# EAGLE schematic ATmga8_testBoard_v4 (EAGLE 6.5.0)
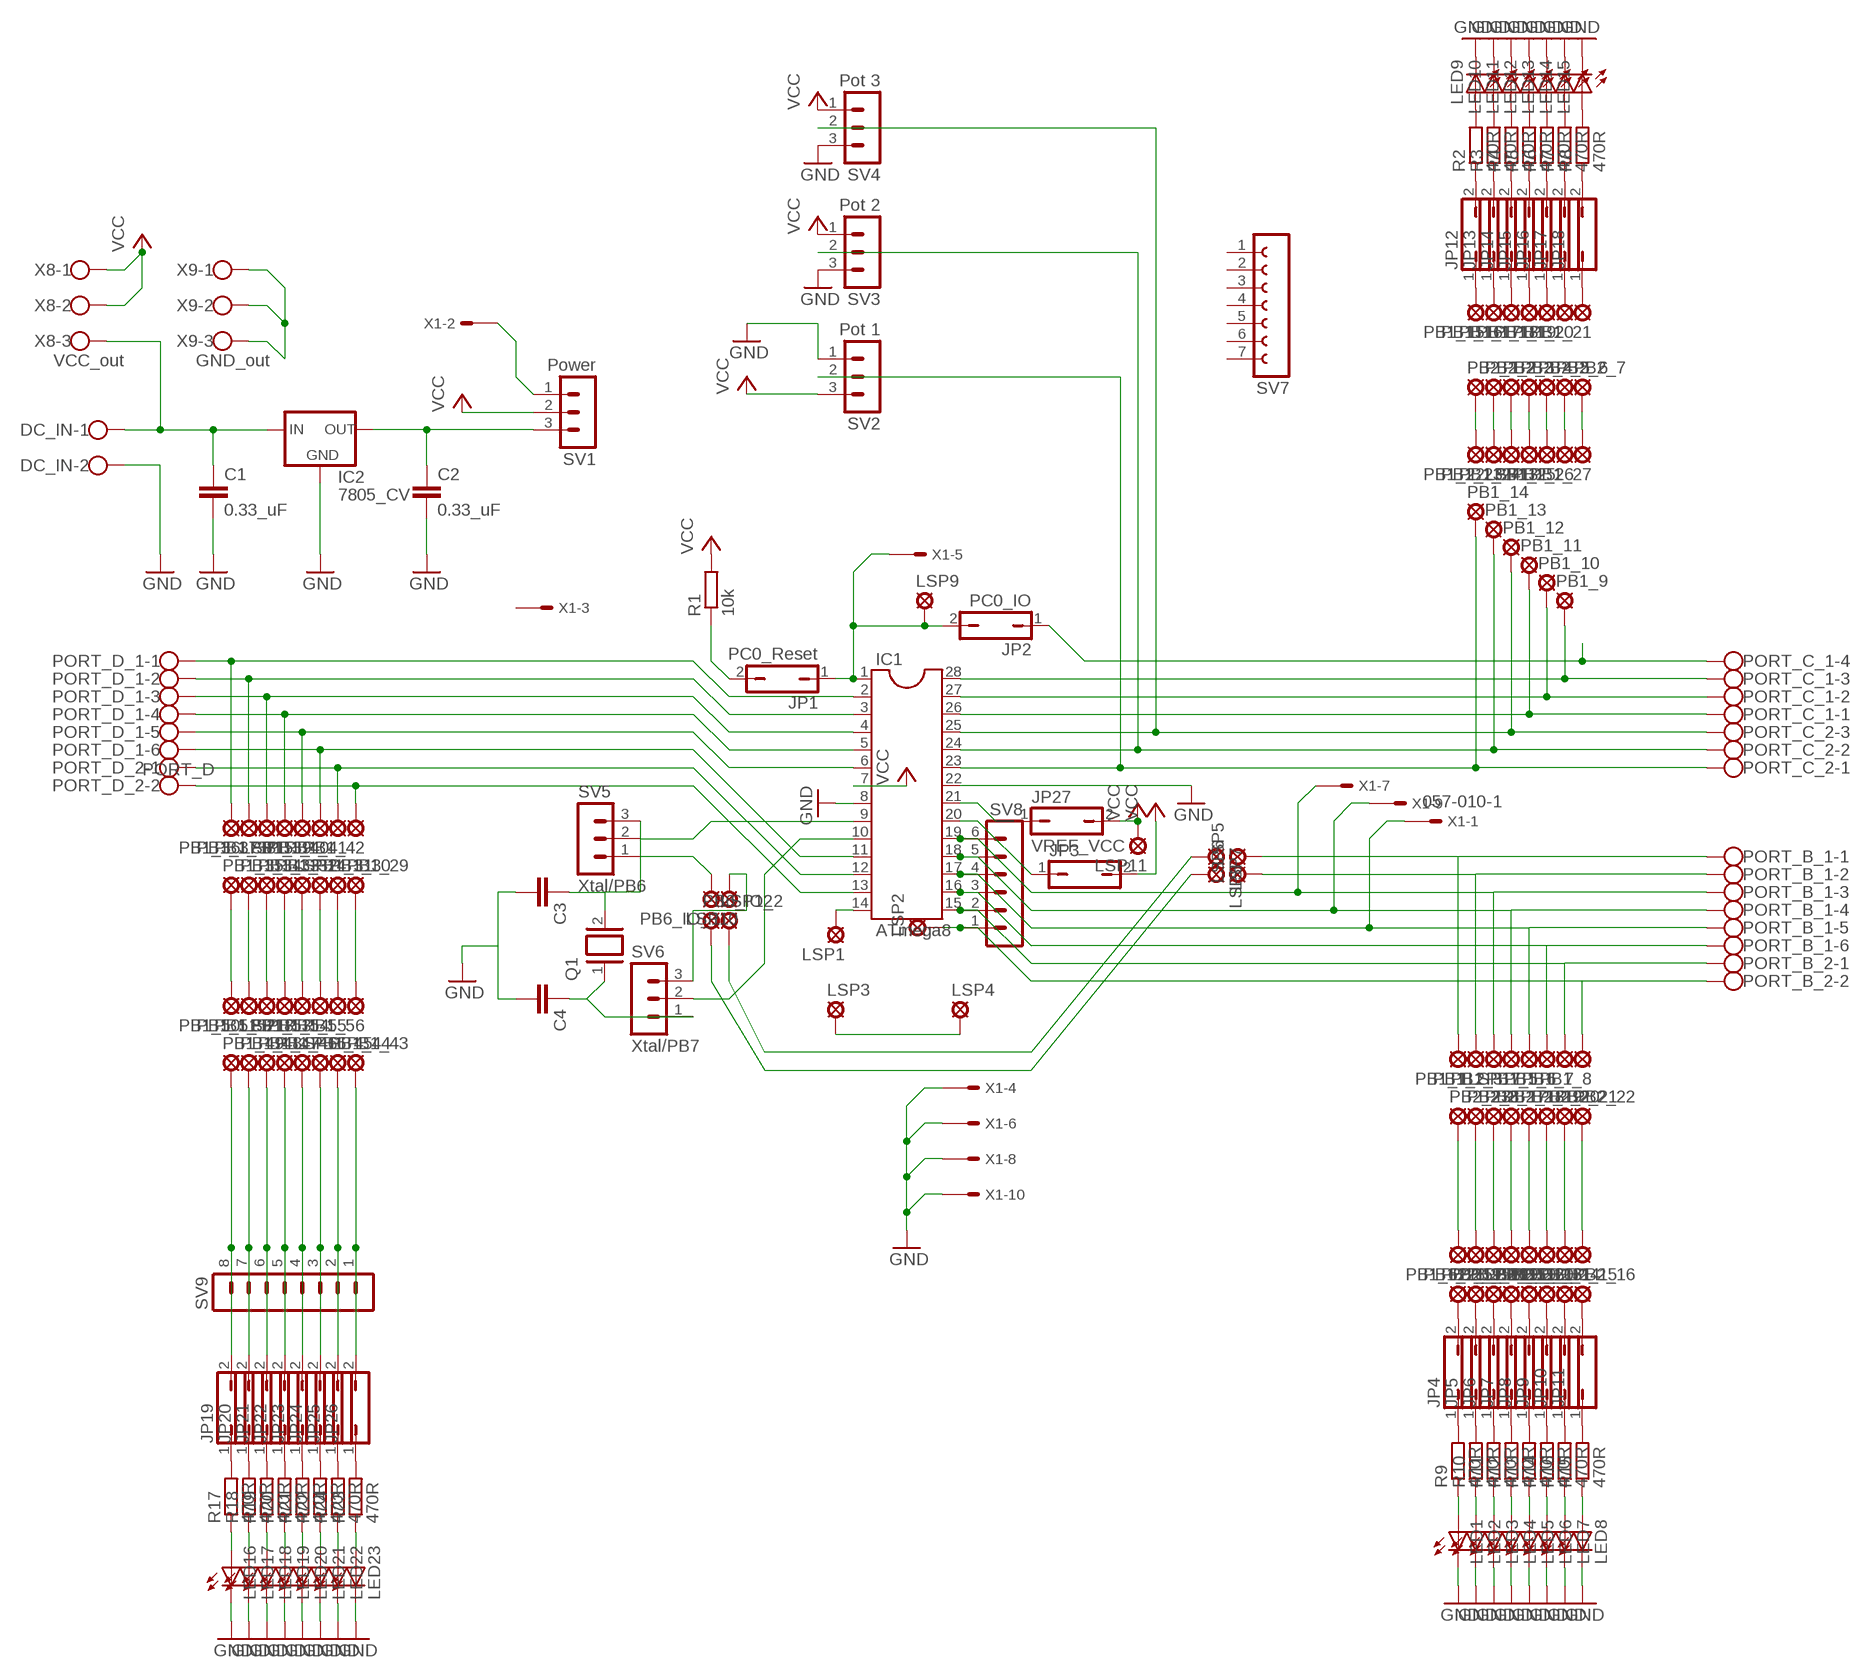
[diagram p0: schematic, sheet 1]

## Parts
C1  0.33_uF  C5/2.5  [C5B2.5]
C2  0.33_uF  C5/2.5  [C5B2.5]
C3  C-EU025-024X044  [C025-024X044]
C4  C-EU025-024X044  [C025-024X044]
DC_IN  W237-102  [W237-102]
IC1  ATmega8  DIL28-3  [DIL28-3]
IC2  7805_CV  78XXS  [78XXS]
JP1  PC0_Reset  JP1Q  [JP1]
JP2  PC0_IO  JP1Q  [JP1]
JP3  JP1Q  [JP1]
JP4  JP1Q  [JP1]
JP5  JP1Q  [JP1]
JP6  JP1Q  [JP1]
JP7  JP1Q  [JP1]
JP8  JP1Q  [JP1]
JP9  JP1Q  [JP1]
JP10  JP1Q  [JP1]
JP11  JP1Q  [JP1]
JP12  JP1Q  [JP1]
JP13  JP1Q  [JP1]
JP14  JP1Q  [JP1]
JP15  JP1Q  [JP1]
JP16  JP1Q  [JP1]
JP17  JP1Q  [JP1]
JP18  JP1Q  [JP1]
JP19  JP1Q  [JP1]
JP20  JP1Q  [JP1]
JP21  JP1Q  [JP1]
JP22  JP1Q  [JP1]
JP23  JP1Q  [JP1]
JP24  JP1Q  [JP1]
JP25  JP1Q  [JP1]
JP26  JP1Q  [JP1]
JP27  VREF_VCC  JP1Q  [JP1]
LED1  LED3MM  [LED3MM]
LED2  LED3MM  [LED3MM]
LED3  LED3MM  [LED3MM]
LED4  LED3MM  [LED3MM]
LED5  LED3MM  [LED3MM]
LED6  LED3MM  [LED3MM]
LED7  LED3MM  [LED3MM]
LED8  LED3MM  [LED3MM]
LED9  LED3MM  [LED3MM]
LED10  LED3MM  [LED3MM]
LED11  LED3MM  [LED3MM]
LED12  LED3MM  [LED3MM]
LED13  LED3MM  [LED3MM]
LED14  LED3MM  [LED3MM]
LED15  LED3MM  [LED3MM]
LED16  LED3MM  [LED3MM]
LED17  LED3MM  [LED3MM]
LED18  LED3MM  [LED3MM]
LED19  LED3MM  [LED3MM]
LED20  LED3MM  [LED3MM]
LED21  LED3MM  [LED3MM]
LED22  LED3MM  [LED3MM]
LED23  LED3MM  [LED3MM]
LSP1  LSP10  [LSP10]
LSP2  LSP10  [LSP10]
LSP3  LSP10  [LSP10]
LSP4  LSP10  [LSP10]
LSP5  LSP10  [LSP10]
LSP6  LSP10  [LSP10]
LSP7  LSP10  [LSP10]
LSP8  LSP10  [LSP10]
LSP9  LSP10  [LSP10]
LSP10  LSP10  [LSP10]
LSP11  LSP10  [LSP10]
LSP12  LSP10  [LSP10]
LSP13  LSP10  [LSP10]
LSP14  LSP10  [LSP10]
LSP15  LSP10  [LSP10]
LSP16  LSP10  [LSP10]
LSP17  LSP10  [LSP10]
LSP18  LSP10  [LSP10]
LSP19  LSP10  [LSP10]
PB1_1  LSP10  [LSP10]
PB1_2  LSP10  [LSP10]
PB1_3  LSP10  [LSP10]
PB1_5  LSP10  [LSP10]
PB1_6  LSP10  [LSP10]
PB1_7  LSP10  [LSP10]
PB1_8  LSP10  [LSP10]
PB1_9  LSP10  [LSP10]
PB1_10  LSP10  [LSP10]
PB1_11  LSP10  [LSP10]
PB1_12  LSP10  [LSP10]
PB1_13  LSP10  [LSP10]
PB1_14  LSP10  [LSP10]
PB1_15  LSP10  [LSP10]
PB1_16  LSP10  [LSP10]
PB1_17  LSP10  [LSP10]
PB1_18  LSP10  [LSP10]
PB1_19  LSP10  [LSP10]
PB1_20  LSP10  [LSP10]
PB1_21  LSP10  [LSP10]
PB1_22  LSP10  [LSP10]
PB1_23  LSP10  [LSP10]
PB1_24  LSP10  [LSP10]
PB1_25  LSP10  [LSP10]
PB1_26  LSP10  [LSP10]
PB1_27  LSP10  [LSP10]
PB1_28  LSP10  [LSP10]
PB1_29  LSP10  [LSP10]
PB1_30  LSP10  [LSP10]
PB1_31  LSP10  [LSP10]
PB1_32  LSP10  [LSP10]
PB1_33  LSP10  [LSP10]
PB1_34  LSP10  [LSP10]
PB1_35  LSP10  [LSP10]
PB1_36  LSP10  [LSP10]
PB1_37  LSP10  [LSP10]
PB1_38  LSP10  [LSP10]
PB1_39  LSP10  [LSP10]
PB1_40  LSP10  [LSP10]
PB1_41  LSP10  [LSP10]
PB1_42  LSP10  [LSP10]
PB1_43  LSP10  [LSP10]
PB1_44  LSP10  [LSP10]
PB1_45  LSP10  [LSP10]
PB1_46  LSP10  [LSP10]
PB1_47  LSP10  [LSP10]
PB1_48  LSP10  [LSP10]
PB1_49  LSP10  [LSP10]
PB1_50  LSP10  [LSP10]
PB1_51  LSP10  [LSP10]
PB1_52  LSP10  [LSP10]
PB1_53  LSP10  [LSP10]
PB1_54  LSP10  [LSP10]
PB1_55  LSP10  [LSP10]
PB1_56  LSP10  [LSP10]
PB1_57  LSP10  [LSP10]
PB1_58  LSP10  [LSP10]
PB1_59  LSP10  [LSP10]
PB1_60  LSP10  [LSP10]
PB1_61  LSP10  [LSP10]
PB1_62  LSP10  [LSP10]
PB2_1  LSP10  [LSP10]
PB2_2  LSP10  [LSP10]
PB2_3  LSP10  [LSP10]
PB2_4  LSP10  [LSP10]
PB2_5  LSP10  [LSP10]
PB2_6  LSP10  [LSP10]
PB2_7  LSP10  [LSP10]
PB2_8  LSP10  [LSP10]
PB2_9  LSP10  [LSP10]
PB2_10  LSP10  [LSP10]
PB2_11  LSP10  [LSP10]
PB2_12  LSP10  [LSP10]
PB2_13  LSP10  [LSP10]
PB2_14  LSP10  [LSP10]
PB2_15  LSP10  [LSP10]
PB2_16  LSP10  [LSP10]
PB2_17  LSP10  [LSP10]
PB2_18  LSP10  [LSP10]
PB2_19  LSP10  [LSP10]
PB2_20  LSP10  [LSP10]
PB2_21  LSP10  [LSP10]
PB2_22  LSP10  [LSP10]
PB2_23  LSP10  [LSP10]
PB6_IO_1  LSP10  [LSP10]
PB6_IO_2  LSP10  [LSP10]
PORT_B_1  W237-6  [W237-6]
PORT_B_2  W237-102  [W237-102]
PORT_C_1  W237-4  [W237-4]
PORT_C_2  W237-103  [W237-103]
PORT_D_1  PORT_D  W237-6  [W237-6]
PORT_D_2  W237-102  [W237-102]
Q1  XTAL  [Q]
R1  10k  R-EU_0204/7  [0204/7]
R2  470R  R-EU_0207/7  [0207/7]
R3  470R  R-EU_0207/7  [0207/7]
R4  470R  R-EU_0207/7  [0207/7]
R5  470R  R-EU_0207/7  [0207/7]
R6  470R  R-EU_0207/7  [0207/7]
R7  470R  R-EU_0207/7  [0207/7]
R8  470R  R-EU_0207/7  [0207/7]
R9  470R  R-EU_0207/7  [0207/7]
R10  470R  R-EU_0207/7  [0207/7]
R11  470R  R-EU_0207/7  [0207/7]
R12  470R  R-EU_0207/7  [0207/7]
R13  470R  R-EU_0207/7  [0207/7]
R14  470R  R-EU_0207/7  [0207/7]
R15  470R  R-EU_0207/7  [0207/7]
R16  470R  R-EU_0207/7  [0207/7]
R17  470R  R-EU_0207/7  [0207/7]
R18  470R  R-EU_0207/7  [0207/7]
R19  470R  R-EU_0207/7  [0207/7]
R20  470R  R-EU_0207/7  [0207/7]
R21  470R  R-EU_0207/7  [0207/7]
R22  470R  R-EU_0207/7  [0207/7]
R23  470R  R-EU_0207/7  [0207/7]
R24  470R  R-EU_0207/7  [0207/7]
SV1  Power  MA03-1  [MA03-1]
SV2  Pot 1  MA03-1  [MA03-1]
SV3  Pot 2  MA03-1  [MA03-1]
SV4  Pot 3  MA03-1  [MA03-1]
SV5  Xtal/PB6  MA03-1  [MA03-1]
SV6  Xtal/PB7  MA03-1  [MA03-1]
SV7  FE07-1  [FE07]
SV8  MA06-1  [MA06-1]
SV9  MA08-1  [MA08-1]
X1  057-010-1  [057-010-1]
X8  VCC_out  W237-103  [W237-103]
X9  GND_out  W237-103  [W237-103]

## Nets
AVCC: IC1.19 PB1_3.MP PORT_B_1.3 SV8.6 X1.7
N$1: C2.1 IC2.OUT SV1.3
N$2: C1.1 DC_IN.1 IC2.IN X8.3
N$3: IC1.1 JP1.1 JP2.2 LSP9.MP X1.5
N$5: IC1.14 LSP1.MP
N$6: LSP3.MP LSP4.MP
N$8: PB1_22.MP PB2_1.MP
N$9: PB1_23.MP PB2_2.MP
N$10: PB1_24.MP PB2_3.MP
N$11: LSP13.MP PB2_4.MP
N$12: LSP8.MP PB6_IO_2.MP
N$13: IC1.20 JP3.1
N$14: LSP7.MP LSP12.MP
N$15: IC1.23 PB1_14.MP PORT_C_2.1 SV2.2
N$16: IC1.24 PB1_13.MP PORT_C_2.2 SV3.2
N$18: IC1.26 PB1_11.MP PORT_C_1.1
N$19: IC1.27 PB1_10.MP PORT_C_1.2
N$20: IC1.28 PB1_9.MP PORT_C_1.3
N$21: JP2.1 PORT_C_1.4
N$22: JP1.2 R1.1
N$23: PB1_25.MP PB2_5.MP
N$24: PB1_26.MP PB2_6.MP
N$25: IC1.10 SV6.2
N$26: IC1.9 SV5.2
N$27: IC1.2 PB1_36.MP PORT_D_1.1
N$28: IC1.3 PB1_37.MP PORT_D_1.2
N$29: IC1.4 PB1_38.MP PORT_D_1.3
N$30: IC1.5 LSP15.MP PORT_D_1.4
N$31: IC1.6 PB1_39.MP PORT_D_1.5
N$32: PB1_28.MP PB2_8.MP
N$33: C4.1 Q1.1 SV6.1
N$34: C3.1 Q1.2 SV5.3
N$35: LSP10.MP SV6.3
N$36: PB6_IO_1.MP SV5.1
N$37: IC1.11 PB1_40.MP PORT_D_1.6
N$38: IC1.12 PB1_41.MP PORT_D_2.1
N$39: IC1.13 PB1_42.MP PORT_D_2.2
N$40: IC1.18 LSP17.MP PORT_B_1.4 SV8.5 X1.9
N$41: IC1.17 PB1_5.MP PORT_B_1.5 SV8.4 X1.1
N$42: IC1.16 PB1_6.MP PORT_B_1.6 SV8.3
N$43: IC1.15 PB1_7.MP PORT_B_2.1 SV8.2
N$44: LSP2.MP PB1_8.MP PORT_B_2.2 SV8.1
N$45: PB1_27.MP PB2_7.MP
N$46: IC1.21 JP27.1
N$47: JP4.1 R9.2
N$48: JP5.1 R10.2
N$49: JP6.1 R11.2
N$50: JP7.1 R12.2
N$51: JP13.1 PB1_16.MP
N$52: JP9.1 R14.2
N$53: JP11.1 R15.2
N$54: JP10.1 R16.2
N$55: LED9.A R2.2
N$56: JP14.1 PB1_17.MP
N$58: JP15.1 PB1_18.MP
N$59: JP17.2 R7.1
N$60: JP17.1 PB1_20.MP
N$61: JP18.1 PB1_21.MP
N$62: JP12.2 R2.1
N$65: JP14.2 R4.1
N$66: JP16.2 R6.1
N$67: JP13.2 R3.1
N$68: JP18.2 R8.1
N$69: LED1.A R9.1
N$70: LED2.A R10.1
N$71: LED3.A R11.1
N$72: LED4.A R12.1
N$73: LED5.A R13.1
N$74: LED7.A R16.1
N$75: LED6.A R14.1
N$76: LED8.A R15.1
N$78: LED10.A R3.2
N$79: LED11.A R4.2
N$80: LED12.A R5.2
N$81: LED13.A R6.2
N$82: LED14.A R7.2
N$83: LED15.A R8.2
N$84: JP4.2 PB2_9.MP
N$85: JP5.2 PB2_10.MP
N$87: JP7.2 PB2_12.MP
N$88: JP8.2 PB2_13.MP
N$89: JP9.2 PB2_14.MP
N$90: JP10.2 PB2_15.MP
N$92: PB1_35.MP PB1_50.MP
N$93: PB1_34.MP PB1_51.MP
N$94: PB1_33.MP PB1_52.MP
N$95: LSP18.MP PB1_32.MP
N$96: LSP14.MP PB1_53.MP
N$97: PB1_31.MP PB1_54.MP
N$98: PB1_30.MP PB1_55.MP
N$99: PB1_29.MP PB1_56.MP
N$100: JP19.1 R17.2
N$101: JP20.1 R18.2
N$102: JP21.1 R19.2
N$104: JP23.1 R21.2
N$105: JP24.1 R22.2
N$107: JP25.1 R24.2
N$108: LED16.A R17.1
N$109: LED17.A R18.1
N$110: LED18.A R19.1
N$111: LED19.A R20.1
N$112: LED20.A R21.1
N$113: LED22.A R24.1
N$114: LED21.A R22.1
N$115: LED23.A R23.1
N$117: JP20.2 PB1_48.MP SV9.7
N$118: JP21.2 PB1_47.MP SV9.6
N$119: JP22.2 PB1_46.MP SV9.5
N$121: JP24.2 PB1_45.MP SV9.3
N$122: JP25.2 PB1_44.MP SV9.2
N$123: JP26.2 PB1_43.MP SV9.1
N$124: PB1_57.MP PB2_17.MP
N$125: PB1_58.MP PB2_18.MP
N$126: LSP19.MP PB2_19.MP
N$127: PB1_59.MP PB2_20.MP
N$128: PB1_60.MP PB2_21.MP
N$129: PB1_61.MP PB2_22.MP
N$130: PB1_62.MP PB2_23.MP
N$137: X9.1 X9.2 X9.3
N$139: C1.2 C2.2 C3.2 C4.2 DC_IN.2 IC1.8 IC1.22 IC2.GND LED1.K(C) LED2.K(C) LED3.K(C) LED4.K(C) LED5.K(C) LED6.K(C) LED7.K(C) LED8.K(C) LED9.K(C) LED10.K(C) LED11.K(C) LED12.K(C) LED13.K(C) LED14.K(C) LED15.K(C) LED16.K(C) LED17.K(C) LED18.K(C) LED19.K(C) LED20.K(C) LED21.K(C) LED22.K(C) LED23.K(C) SV2.1 SV3.3 SV4.3 X1.4 X1.6 X1.8 X1.10 ; supply symbol labelled GND
N$152: SV1.1 X1.2
N$161: JP23.2 LSP16.MP SV9.4
N$163: IC1.25 PB1_12.MP PORT_C_2.3 SV4.2
N$168: JP8.1 R13.2
N$173: JP16.1 PB1_19.MP
N$174: JP11.2 PB2_16.MP
N$177: JP15.2 R5.1
N$178: JP12.1 PB1_15.MP
N$186: JP6.2 PB2_11.MP
N$187: LSP6.MP PB1_2.MP PORT_B_1.2
N$188: JP26.1 R23.2
N$189: JP22.1 R20.2
N$209: JP19.2 PB1_49.MP SV9.8
N$216: LSP5.MP PB1_1.MP PORT_B_1.1
VCC: IC1.7 JP3.2 JP27.2 LSP11.MP R1.2 SV1.2 SV2.3 SV3.1 SV4.1 X8.1 X8.2
Unconnected: SV7.1 SV7.2 SV7.3 SV7.4 SV7.5 SV7.6 SV7.7 X1.3

## Library data of the parts
C1 C2 = capacitor-wima:C: CAPACITOR naming: grid - package width
C3 C4 = rcl:C-EU: CAPACITOR, European symbol
DC_IN PORT_B_2 PORT_D_2 = con-wago-500:W237-102: WAGO SCREW CLAMP; MPN: 237-102; OC_FARNELL: unknown; OC_NEWARK: 70K9898
IC1 = ic-package:DIL28: Dual In Line
IC2 = v-reg:78XXS: VOLTAGE REGULATOR
JP1-JP27 = jumper:JP1Q: JUMPER
LED1-LED23 = led:LED: LED OSRAM: - CHIPLED LG R971, LG N971, LY N971, LG Q971, LY Q971, LO R971, LY R971 LH N974, LH R974 LS Q976, LO Q976, LY Q976 LO Q996 - Hyper CHIPLED LW Q18S LB Q993, LB Q99A, LB R99A - SideLED LS A670, LO A670, LY A670, LG A670, LP A670 LB A673, LV A673, LT A673, LW A673 LH A674 LY A675 LS A676, LA A676, LO A676, LY A676, LW A676 LS A679, LY A679, LG A679 - Hyper Micro SIDELED® LS Y876, LA Y876, LO Y876, LY Y876 LT Y87S - SmartLED LW L88C, LW L88S LB L89C, LB L89S, LG L890 LS L89K, LO L89K, LY L89K LS L896, LA L896, LO L896, LY L896 - TOPLED LS T670, LO T670, LY T670, LG T670, LP T670 LSG T670, LSP T670, LSY T670, LOP T670, LYG T670 LG T671, LOG T671, LSG T671 LB T673, LV T673, LT T673, LW T673 LH T674 LS T676, LA T676, LO T676, LY T676, LB T676, LH T676, LSB T676, LW T676 LB T67C, LV T67C, LT T67C, LS T67K, LO T67K, LY T67K, LW E67C LS E67B, LA E67B, LO E67B, LY E67B, LB E67C, LV E67C, LT E67C LW T67C LS T679, LY T679, LG T679 LS T770, LO T770, LY T770, LG T770, LP T770 LB T773, LV T773, LT T773, LW T773 LH T774 LS E675, LA E675, LY E675, LS T675 LS T776, LA T776, LO T776, LY T776, LB T776 LHGB T686 LT T68C, LB T68C - Hyper Mini TOPLED® LB M676 - Mini TOPLED Santana® LG M470 LS M47K, LO M47K, LY M47K Source: http://www.osram.convergy.de LUXEON: - LUMILED® LXK2-PW12-R00, LXK2-PW12-S00, LXK2-PW14-U00, LXK2-PW14-V00 LXK2-PM12-R00, LXK2-PM12-S00, LXK2-PM14-U00 LXK2-PE12-Q00, LXK2-PE12-R00, LXK2-PE12-S00, LXK2-PE14-T00, LXK2-PE14-U00 LXK2-PB12-K00, LXK2-PB12-L00, LXK2-PB12-M00, LXK2-PB14-N00, LXK2-PB14-P00, LXK2-PB14-Q00 LXK2-PR12-L00, LXK2-PR12-M00, LXK2-PR14-Q00, LXK2-PR14-R00 LXK2-PD12-Q00, LXK2-PD12-R00, LXK2-PD12-S00 LXK2-PH12-R00, LXK2-PH12-S00 LXK2-PL12-P00, LXK2-PL12-Q00, LXK2-PL12-R00 Source: www.luxeon.com KINGBRIGHT: KA-3528ASYC Source: www.kingbright.com
LSP1-LSP19 PB1_1-PB1_3 PB1_5-PB1_62 PB2_1-PB2_23 PB6_IO_1 PB6_IO_2 = solpad:LSP10: SOLDER PAD drill 1.0 mm, distributor Buerklin, 12H555
PORT_B_1 PORT_D_1 = con-wago-500:W237-6: WAGO SCREW CLAMP; OC_FARNELL: unknown; OC_NEWARK: unknown
PORT_C_1 = con-wago-500:W237-4: WAGO SCREW CLAMP; OC_FARNELL: unknown; OC_NEWARK: unknown
PORT_C_2 X8 X9 = con-wago-500:W237-103: WAGO SCREW CLAMP; MPN: 237-103; OC_FARNELL: unknown; OC_NEWARK: 18M7116
Q1 = special:XTAL: CRYSTAL
R1 = resistor:R-EU_: RESISTOR, European symbol
R2-R24 = rcl:R-EU_: RESISTOR, European symbol
SV1-SV6 = con-lstb:MA03-1: PIN HEADER; OC_FARNELL: unknown; OC_NEWARK: unknown
SV7 = con-lsta:FE07-1: FEMALE HEADER; OC_FARNELL: unknown; OC_NEWARK: unknown
SV8 = con-lstb:MA06-1: PIN HEADER; OC_FARNELL: unknown; OC_NEWARK: unknown
SV9 = con-lstb:MA08-1: PIN HEADER; OC_FARNELL: unknown; OC_NEWARK: unknown
X1 = con-panduit:057-010-: CONNECTOR 10-pin series 057 contact pc board low profile headers; OC_FARNELL: unknown; OC_NEWARK: unknown